# Altium schematic sheet Throttle Interfaces.SchDoc
size A4; Organization: TESLA Motors, INC; Address1: 3500 Deer Creek Road; Address2: Palo Alto, CA; Address4: U.S.A.; SheetNumber: 12; SheetTotal: 21
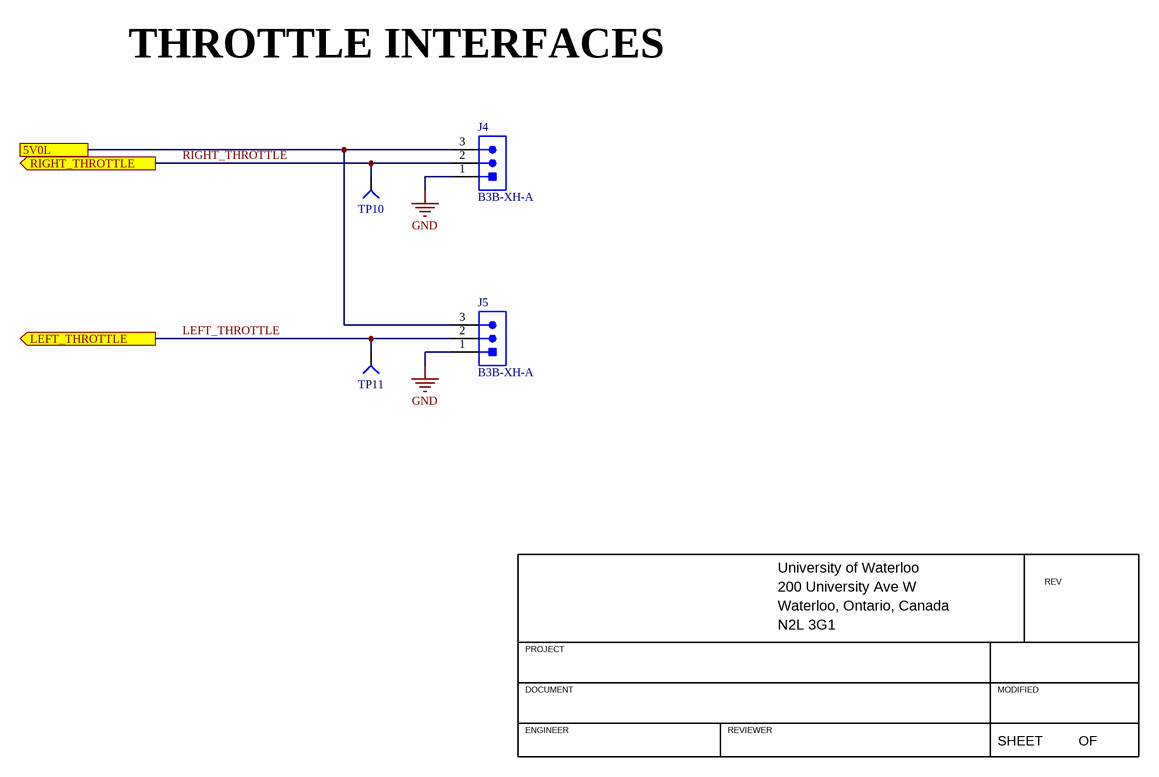
[diagram p0: Throttle Interfaces.SchDoc]

## Parts
J4  Manufacturer Part Number 1: B3B-XH-A  [JST_XH_3POS]  (hidden comment: CON_JST_3POS)
J5  Manufacturer Part Number 1: B3B-XH-A  [JST_XH_3POS]  (hidden comment: CON_JST_3POS)
TP10  TESTPOINT_1MM_CIRCLE  [TESTPOINT_CIRCLE_1MM]  (value not drawn)  (no BOM)
TP11  TESTPOINT_1MM_CIRCLE  [TESTPOINT_CIRCLE_1MM]  (value not drawn)  (no BOM)

## Ports
5V0L, LEFT_THROTTLE (out), RIGHT_THROTTLE (out)

## Nets
GND: J4.1 J5.1
5V0L: J4.3 J5.3 ; port 5V0L
LEFT_THROTTLE: J5.2 TP11.1(=value) ; port LEFT_THROTTLE
RIGHT_THROTTLE: J4.2 TP10.1(=value) ; port RIGHT_THROTTLE

## Notes on the sheet
- THROTTLE INTERFACES
- University of Waterloo
- 200 University Ave W
- REV
- PROJECT
- Waterloo, Ontario, Canada
- N2L 3G1
- DOCUMENT
- ENGINEER
- REVIEWER
- MODIFIED
- SHEET
- OF

## Library data of the parts
J4 J5 = CON_JST_3POS: CONN HEADER VERT 3POS 2.5MM; Manufacturer 1: JST Sales America Inc.; Voltage Rating: 250VAC; Current Rating: 3A; Pitch: 2.5mm; Supplier 1: Digi-Key; Supplier Part Number 1: 455-2248-ND
TP10 TP11 = TESTPOINT_1MM_CIRCLE: TESTPOINT 1MM CIRCLE